# Altium project PnP.PrjPcb (part 2 of 2)

## Sheet ENET.SchDoc: ENET PHY
size 431 x 279 mm; Author: Shivam Sharma; SheetNumber: 4; SheetTotal: 14; SheetRevision: 1.0
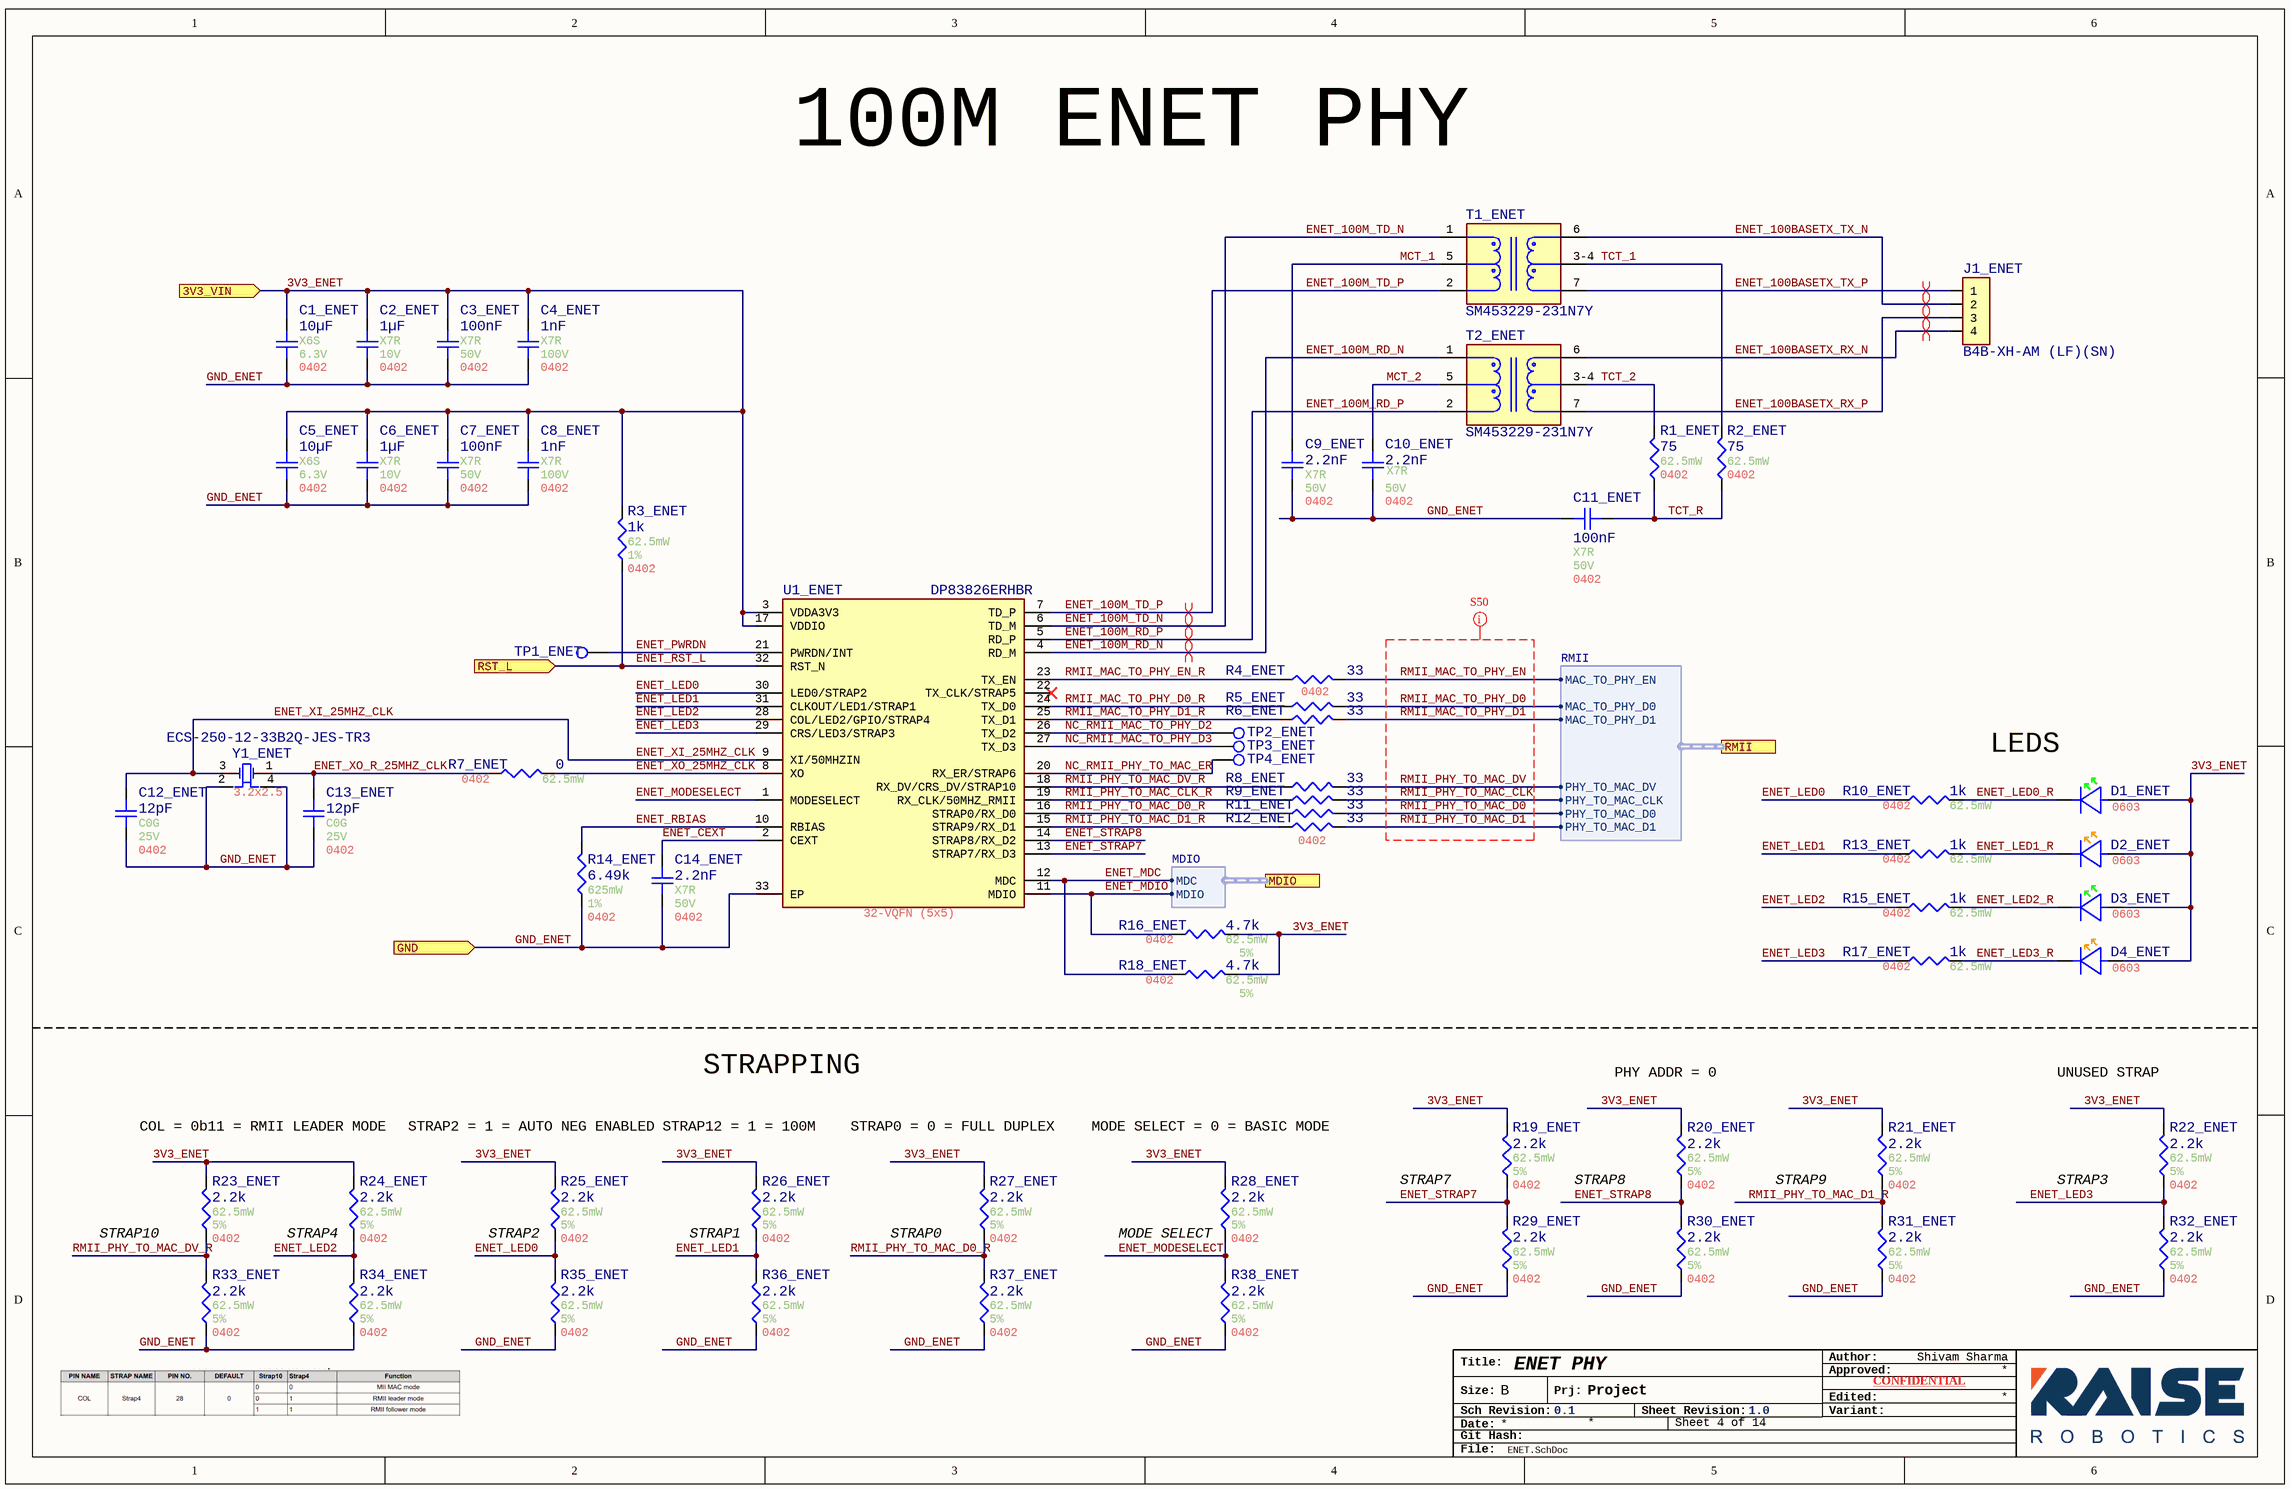
[diagram p6: ENET.SchDoc]

### Parts
C1_ENET  value 10µF  Temperature Coefficient: X6S  Voltage Rating: 6.3V  Case/Package: 0402  [Generic 0402 capacitor]  (hidden comment: GRT155C80J106ME13J)
C2_ENET  value 1µF  Temperature Coefficient: X7R  Voltage Rating: 10V  Case/Package: 0402  [Generic 0402 capacitor]  (hidden comment: MAASL105CD7105MFCA01)
C3_ENET  value 100nF  Temperature Coefficient: X7R  Voltage Rating: 50V  Case/Package: 0402  [Generic 0402 capacitor]  (hidden comment: GRT155R71H104KE01D)
C4_ENET  value 1nF  Temperature Coefficient: X7R  Voltage Rating: 100V  Case/Package: 0402  [Generic 0402 capacitor]  (hidden comment: GCM155R72A102KA37J)
C5_ENET  value 10µF  Temperature Coefficient: X6S  Voltage Rating: 6.3V  Case/Package: 0402  [Generic 0402 capacitor]  (hidden comment: GRT155C80J106ME13J)
C6_ENET  value 1µF  Temperature Coefficient: X7R  Voltage Rating: 10V  Case/Package: 0402  [Generic 0402 capacitor]  (hidden comment: MAASL105CD7105MFCA01)
C7_ENET  value 100nF  Temperature Coefficient: X7R  Voltage Rating: 50V  Case/Package: 0402  [Generic 0402 capacitor]  (hidden comment: GRT155R71H104KE01D)
C8_ENET  value 1nF  Temperature Coefficient: X7R  Voltage Rating: 100V  Case/Package: 0402  [Generic 0402 capacitor]  (hidden comment: GCM155R72A102KA37J)
C9_ENET  value 2.2nF  Temperature Coefficient: X7R  Voltage Rating: 50V  Case/Package: 0402  [Generic 0402 capacitor]  (hidden comment: CGA2B2X7R1H222K050BA)
C10_ENET  value 2.2nF  Temperature Coefficient: X7R  Voltage Rating: 50V  Case/Package: 0402  [Generic 0402 capacitor]  (hidden comment: CGA2B2X7R1H222K050BA)
C11_ENET  value 100nF  Temperature Coefficient: X7R  Voltage Rating: 50V  Case/Package: 0402  [Generic 0402 capacitor]  (hidden comment: GRT155R71H104KE01D)
C12_ENET  value 12pF  Temperature Coefficient: C0G  Voltage Rating: 25V  Case/Package: 0402  [Generic 0402 capacitor]  (hidden comment: GRT1555C1E120JA02J)
C13_ENET  value 12pF  Temperature Coefficient: C0G  Voltage Rating: 25V  Case/Package: 0402  [Generic 0402 capacitor]  (hidden comment: GRT1555C1E120JA02J)
C14_ENET  value 2.2nF  Temperature Coefficient: X7R  Voltage Rating: 50V  Case/Package: 0402  [Generic 0402 capacitor]  (hidden comment: CGA2B2X7R1H222K050BA)
D1_ENET  Case/Package: 0603  [SML-D12P8WT86C]  (hidden comment: SML-D12P8WT86C)
D2_ENET  Case/Package: 0603  [FP-SML-D12-MFG]  (hidden comment: SML-D12D8WT86C)
D3_ENET  Case/Package: 0603  [SML-D12P8WT86C]  (hidden comment: SML-D12P8WT86C)
D4_ENET  Case/Package: 0603  [FP-SML-D12-MFG]  (hidden comment: SML-D12D8WT86C)
J1_ENET  B4B-XH-AM (LF)(SN)  [FP-B4B-XH-AM_LF_SN-MFG]
R1_ENET  value 75  Power: 62.5mW  Case/Package: 0402  [Generic 0402 Resistor]  (hidden comment: WR04X75R0FTL)
R2_ENET  value 75  Power: 62.5mW  Case/Package: 0402  [Generic 0402 Resistor]  (hidden comment: WR04X75R0FTL)
R3_ENET  value 1k  Power: 62.5mW  Tolerance: 1%  Case/Package: 0402  [Generic 0402 Resistor]  (hidden comment: WR04X1001FTL)
R4_ENET  value 33  [Generic 0402 Resistor]  (hidden comment: RMCA0402FT33R0-HP)
R5_ENET  value 33  [Generic 0402 Resistor]  (hidden comment: RMCA0402FT33R0-HP)
R6_ENET  value 33  Case/Package: 0402  [Generic 0402 Resistor]  (hidden comment: RMCA0402FT33R0-HP)
R7_ENET  value 0  Power: 62.5mW  Case/Package: 0402  [Generic 0402 Resistor]  (hidden comment: WR04X000PTL)
R8_ENET  value 33  [Generic 0402 Resistor]  (hidden comment: RMCA0402FT33R0-HP)
R9_ENET  value 33  [Generic 0402 Resistor]  (hidden comment: RMCA0402FT33R0-HP)
R10_ENET  value 1k  Power: 62.5mW  Case/Package: 0402  [Generic 0402 Resistor]  (hidden comment: WR04X1001FTL)
R11_ENET  value 33  [Generic 0402 Resistor]  (hidden comment: RMCA0402FT33R0-HP)
R12_ENET  value 33  Case/Package: 0402  [Generic 0402 Resistor]  (hidden comment: RMCA0402FT33R0-HP)
R13_ENET  value 1k  Power: 62.5mW  Case/Package: 0402  [Generic 0402 Resistor]  (hidden comment: WR04X1001FTL)
R14_ENET  value 6.49k  Power: 625mW  Tolerance: 1%  Case/Package: 0402  [Generic 0402 Resistor]  (hidden comment: AC0402FR-076K49L)
R15_ENET  value 1k  Power: 62.5mW  Case/Package: 0402  [Generic 0402 Resistor]  (hidden comment: WR04X1001FTL)
R16_ENET  value 4.7k  Power: 62.5mW  Tolerance: 5%  Case/Package: 0402  [Generic 0402 Resistor]  (hidden comment: WR04X472JTL)
R17_ENET  value 1k  Power: 62.5mW  Case/Package: 0402  [Generic 0402 Resistor]  (hidden comment: WR04X1001FTL)
R18_ENET  value 4.7k  Power: 62.5mW  Tolerance: 5%  Case/Package: 0402  [Generic 0402 Resistor]  (hidden comment: WR04X472JTL)
R19_ENET  value 2.2k  Power: 62.5mW  Tolerance: 5%  Case/Package: 0402  [Generic 0402 Resistor]  (hidden comment: CR0402-JW-222GLF)
R20_ENET  value 2.2k  Power: 62.5mW  Tolerance: 5%  Case/Package: 0402  [Generic 0402 Resistor]  (hidden comment: CR0402-JW-222GLF)
R21_ENET  value 2.2k  Power: 62.5mW  Tolerance: 5%  Case/Package: 0402  [Generic 0402 Resistor]  (hidden comment: CR0402-JW-222GLF)
R22_ENET  value 2.2k  Power: 62.5mW  Tolerance: 5%  Case/Package: 0402  [Generic 0402 Resistor]  (hidden comment: CR0402-JW-222GLF)
R23_ENET  value 2.2k  Power: 62.5mW  Tolerance: 5%  Case/Package: 0402  [Generic 0402 Resistor]  (hidden comment: CR0402-JW-222GLF)
R24_ENET  value 2.2k  Power: 62.5mW  Tolerance: 5%  Case/Package: 0402  [Generic 0402 Resistor]  (hidden comment: CR0402-JW-222GLF)
R25_ENET  value 2.2k  Power: 62.5mW  Tolerance: 5%  Case/Package: 0402  [Generic 0402 Resistor]  (hidden comment: CR0402-JW-222GLF)
R26_ENET  value 2.2k  Power: 62.5mW  Tolerance: 5%  Case/Package: 0402  [Generic 0402 Resistor]  (hidden comment: CR0402-JW-222GLF)
R27_ENET  value 2.2k  Power: 62.5mW  Tolerance: 5%  Case/Package: 0402  [Generic 0402 Resistor]  (hidden comment: CR0402-JW-222GLF)
R28_ENET  value 2.2k  Power: 62.5mW  Tolerance: 5%  Case/Package: 0402  [Generic 0402 Resistor]  (hidden comment: CR0402-JW-222GLF)
R29_ENET  value 2.2k  Power: 62.5mW  Tolerance: 5%  Case/Package: 0402  [Generic 0402 Resistor]  (hidden comment: CR0402-JW-222GLF)
R30_ENET  value 2.2k  Power: 62.5mW  Tolerance: 5%  Case/Package: 0402  [Generic 0402 Resistor]  (hidden comment: CR0402-JW-222GLF)
R31_ENET  value 2.2k  Power: 62.5mW  Tolerance: 5%  Case/Package: 0402  [Generic 0402 Resistor]  (hidden comment: CR0402-JW-222GLF)
R32_ENET  value 2.2k  Power: 62.5mW  Tolerance: 5%  Case/Package: 0402  [Generic 0402 Resistor]  (hidden comment: CR0402-JW-222GLF)
R33_ENET  value 2.2k  Power: 62.5mW  Tolerance: 5%  Case/Package: 0402  [Generic 0402 Resistor]  (hidden comment: CR0402-JW-222GLF)
R34_ENET  value 2.2k  Power: 62.5mW  Tolerance: 5%  Case/Package: 0402  [Generic 0402 Resistor]  (hidden comment: CR0402-JW-222GLF)
R35_ENET  value 2.2k  Power: 62.5mW  Tolerance: 5%  Case/Package: 0402  [Generic 0402 Resistor]  (hidden comment: CR0402-JW-222GLF)
R36_ENET  value 2.2k  Power: 62.5mW  Tolerance: 5%  Case/Package: 0402  [Generic 0402 Resistor]  (hidden comment: CR0402-JW-222GLF)
R37_ENET  value 2.2k  Power: 62.5mW  Tolerance: 5%  Case/Package: 0402  [Generic 0402 Resistor]  (hidden comment: CR0402-JW-222GLF)
R38_ENET  value 2.2k  Power: 62.5mW  Tolerance: 5%  Case/Package: 0402  [Generic 0402 Resistor]  (hidden comment: CR0402-JW-222GLF)
T1_ENET  SM453229-231N7Y  [SM453229-231N7Y]
T2_ENET  SM453229-231N7Y  [SM453229-231N7Y]
TP1_ENET  TP 0.75mm  [TP 0.75mm]  (value not drawn)  (no BOM)
TP2_ENET  TP 0.75mm  [TP 0.75mm]  (value not drawn)  (no BOM)
TP3_ENET  TP 0.75mm  [TP 0.75mm]  (value not drawn)  (no BOM)
TP4_ENET  TP 0.75mm  [TP 0.75mm]  (value not drawn)  (no BOM)
U1_ENET  DP83826ERHBR  Case/Package: 32-VQFN (5x5)  [DP83826ERHBR]
Y1_ENET  ECS-250-12-33B2Q-JES-TR3  Case/Package: 3.2x2.5  [ECS-250-12-33B2Q-JES-TR3]

### Ports
3V3_VIN (in), GND (in), MDIO (harness MDIO), RMII (harness RMII), RST_L (in)

### Harnesses
MDIO: MDIO, MDC
RMII: MAC_TO_PHY_D0, MAC_TO_PHY_D1, PHY_TO_MAC_D0, PHY_TO_MAC_CLK, PHY_TO_MAC_D1, MAC_TO_PHY_EN, PHY_TO_MAC_DV

### Nets
3V3_ENET: C1_ENET.2 C2_ENET.2 C3_ENET.2 C4_ENET.2 C5_ENET.2 C6_ENET.2 C7_ENET.2 C8_ENET.2 D1_ENET.2(A) D2_ENET.2(A) D3_ENET.2(A) D4_ENET.2(A) R3_ENET.2 R16_ENET.2 R18_ENET.2 R19_ENET.2 R20_ENET.2 R21_ENET.2 R22_ENET.2 R23_ENET.2 R24_ENET.2 R25_ENET.2 R26_ENET.2 R27_ENET.2 R28_ENET.2 U1_ENET.3(VDDA3V3) U1_ENET.17(VDDIO) ; port 3V3_VIN  [project net 3V3_LOGIC]
GND_ENET: C1_ENET.1 C2_ENET.1 C3_ENET.1 C4_ENET.1 C5_ENET.1 C6_ENET.1 C7_ENET.1 C8_ENET.1 C9_ENET.1 C10_ENET.1 C11_ENET.2 C12_ENET.1 C13_ENET.1 C14_ENET.1 R14_ENET.1 R29_ENET.1 R30_ENET.1 R31_ENET.1 R32_ENET.1 R33_ENET.1 R34_ENET.1 R35_ENET.1 R36_ENET.1 R37_ENET.1 R38_ENET.1 U1_ENET.33(EP) Y1_ENET.2 Y1_ENET.4 ; port GND  [project net GND]
ENET_100BASETX_RX_N: J1_ENET.4 T2_ENET.6
ENET_100BASETX_RX_P: J1_ENET.3 T2_ENET.7
ENET_100BASETX_TX_N: J1_ENET.2 T1_ENET.6
ENET_100BASETX_TX_P: J1_ENET.1 T1_ENET.7
ENET_100M_RD_N: T2_ENET.1 U1_ENET.4(RD_M)
ENET_100M_RD_P: T2_ENET.2 U1_ENET.5(RD_P)
ENET_100M_TD_N: T1_ENET.1 U1_ENET.6(TD_M)
ENET_100M_TD_P: T1_ENET.2 U1_ENET.7(TD_P)
ENET_CEXT: C14_ENET.2 U1_ENET.2(CEXT)
ENET_LED0: R10_ENET.1 R25_ENET.1 R35_ENET.2 U1_ENET.30(LED0/STRAP2)
ENET_LED0_R: D1_ENET.1(C) R10_ENET.2
ENET_LED1: R13_ENET.1 R26_ENET.1 R36_ENET.2 U1_ENET.31(CLKOUT/LED1/STRAP1)
ENET_LED1_R: D2_ENET.1(C) R13_ENET.2
ENET_LED2: R15_ENET.1 R24_ENET.1 R34_ENET.2 U1_ENET.28(COL/LED2/GPIO/STRAP4)
ENET_LED2_R: D3_ENET.1(C) R15_ENET.2
ENET_LED3: R17_ENET.1 R22_ENET.1 R32_ENET.2 U1_ENET.29(CRS/LED3/STRAP3)
ENET_LED3_R: D4_ENET.1(C) R17_ENET.2
ENET_MDC: R18_ENET.1 U1_ENET.12(MDC) ; port MDIO.MDC
ENET_MDIO: R16_ENET.1 U1_ENET.11(MDIO) ; port MDIO.MDIO
ENET_MODESELECT: R28_ENET.1 R38_ENET.2 U1_ENET.1(MODESELECT)
ENET_PWRDN: TP1_ENET.1 U1_ENET.21(PWRDN/INT)
ENET_RBIAS: R14_ENET.2 U1_ENET.10(RBIAS)
ENET_RST_L: R3_ENET.1 U1_ENET.32(RST_N) ; port RST_L
ENET_STRAP7: R19_ENET.1 R29_ENET.2 U1_ENET.13(STRAP7/RX_D3)
ENET_STRAP8: R20_ENET.1 R30_ENET.2 U1_ENET.14(STRAP8/RX_D2)
ENET_XI_25MHZ_CLK: C12_ENET.2 U1_ENET.9(XI/50MHZIN) Y1_ENET.3
ENET_XO_25MHZ_CLK: R7_ENET.2 U1_ENET.8(XO)
ENET_XO_R_25MHZ_CLK: C13_ENET.2 R7_ENET.1 Y1_ENET.1
MCT_1: C9_ENET.2 T1_ENET.5
MCT_2: C10_ENET.2 T2_ENET.5
NC_RMII_MAC_TO_PHY_D2: TP2_ENET.1 U1_ENET.26(TX_D2)
NC_RMII_MAC_TO_PHY_D3: TP3_ENET.1 U1_ENET.27(TX_D3)
NC_RMII_PHY_TO_MAC_ER: TP4_ENET.1 U1_ENET.20(RX_ER/STRAP6)
RMII_MAC_TO_PHY_D0: R5_ENET.2 ; port RMII.MAC_TO_PHY_D0
RMII_MAC_TO_PHY_D0_R: R5_ENET.1 U1_ENET.24(TX_D0)
RMII_MAC_TO_PHY_D1: R6_ENET.2 ; port RMII.MAC_TO_PHY_D1
RMII_MAC_TO_PHY_D1_R: R6_ENET.1 U1_ENET.25(TX_D1)
RMII_MAC_TO_PHY_EN: R4_ENET.2 ; port RMII.MAC_TO_PHY_EN
RMII_MAC_TO_PHY_EN_R: R4_ENET.1 U1_ENET.23(TX_EN)
RMII_PHY_TO_MAC_CLK: R9_ENET.2 ; port RMII.PHY_TO_MAC_CLK
RMII_PHY_TO_MAC_CLK_R: R9_ENET.1 U1_ENET.19(RX_CLK/50MHZ_RMII)
RMII_PHY_TO_MAC_D0: R11_ENET.2 ; port RMII.PHY_TO_MAC_D0
RMII_PHY_TO_MAC_D0_R: R11_ENET.1 R27_ENET.1 R37_ENET.2 U1_ENET.16(STRAP0/RX_D0)
RMII_PHY_TO_MAC_D1: R12_ENET.2 ; port RMII.PHY_TO_MAC_D1
RMII_PHY_TO_MAC_D1_R: R12_ENET.1 R21_ENET.1 R31_ENET.2 U1_ENET.15(STRAP9/RX_D1)
RMII_PHY_TO_MAC_DV: R8_ENET.2 ; port RMII.PHY_TO_MAC_DV
RMII_PHY_TO_MAC_DV_R: R8_ENET.1 R23_ENET.1 R33_ENET.2 U1_ENET.18(RX_DV/CRS_DV/STRAP10)
TCT_1: R2_ENET.2 T1_ENET.3-4
TCT_2: R1_ENET.2 T2_ENET.3-4
TCT_R: C11_ENET.1 R1_ENET.1 R2_ENET.1

Not connected (* = marked no-connect by the designer): U1_ENET 22(TX_CLK/STRAP5)*

### Layout directives
differential pair: ENET_100BASETX_RX_N, ENET_100BASETX_RX_P, ENET_100BASETX_TX_N, ENET_100BASETX_TX_P, ENET_100M_RD_N, ENET_100M_RD_P, ENET_100M_TD_N, ENET_100M_TD_P
net class S50: RMII_MAC_TO_PHY_D0, RMII_MAC_TO_PHY_D1, RMII_MAC_TO_PHY_EN, RMII_PHY_TO_MAC_CLK, RMII_PHY_TO_MAC_D0, RMII_PHY_TO_MAC_D1, RMII_PHY_TO_MAC_DV

### Notes on the sheet
- 100M ENET PHY
- LEDS
- STRAPPING
- PHY ADDR = 0
- UNUSED STRAP
- COL = 0b11 = RMII LEADER MODE
- STRAP2 = 1 = AUTO NEG ENABLED
- STRAP12 = 1 = 100M
- STRAP0 = 0 = FULL DUPLEX
- MODE SELECT = 0 = BASIC MODE
- STRAP10
- (near R24_ENET) STRAP4
- (near R25_ENET) STRAP2
- (near R26_ENET) STRAP1
- STRAP0
- (near R28_ENET) MODE SELECT
- STRAP7
- STRAP8
- STRAP9
- STRAP3
- Title:
- Author:
- Approved:
- Size:
- Date:
- Git Hash:
- Sch Revision:
- B
- Prj:
- Sheet Revision:
- Variant:
- Edited:
- CONFIDENTIAL
- File:

### Library data of the parts
C1_ENET C5_ENET = CMP-001-00108-2: Multilayer Ceramic Capacitors MLCC - SMD/SMT 0402 10uF 6.3VDC 20% X6S AEC-Q200; AECQ: Yes; Mounting Technology: Surface Mount; Max Operating Temperature: 105°C; Min Operating Temperature: -55°C; Tolerance: 20%; Pins: 2; RoHS Compliant: Yes; Capacitor Type: Ceramic
C2_ENET C6_ENET = CMP-001-00104-2: Cap Cer 1UF 20V X7T 0402; Capacitor Type: Ceramic; AECQ: Yes; Tolerance: 20%; Max Operating Temperature: 125°C; Min Operating Temperature: -55°C; Mounting Technology: Surface Mount; RoHS Compliant: Yes; Pins: 2
C3_ENET C7_ENET C11_ENET = CMP-001-00084-12: Ceramic Capacitor, Multilayer, Ceramic, 50V, 10% +Tol, 10% -Tol, X7R, 15% TC, 0.1uF, Surface Mount, 0402; AECQ: Yes; Reach SVHC Compliant: Yes; Mounting Technology: Surface Mount; Termination: Wraparound; Pins: 2; Packaging: Tape and Reel; Package Shape: Rectangular; Multilayer: Yes; Tolerance: 10%; Max Operating Temperature: 125°C; Terminal Finish: Nickel; Capacitor Type: Ceramic; Dielectric Material: Ceramic; Min Operating Temperature: -55°C; RoHS Compliant: Yes
C4_ENET C8_ENET = CMP-001-00101-2: Ceramic Capacitor, Multilayer, Ceramic, 100V, 10% +Tol, 10% -Tol, X7R, 15% TC, 0.001uF, Surface Mount, 0402; AECQ: Yes; Pins: 2; Tolerance: 10%; Max Operating Temperature: 125°C; Capacitor Type: Ceramic; Mounting Technology: SMD; Min Operating Temperature: -55°C
C9_ENET C10_ENET C14_ENET = CMP-001-00093-4: 50V 2.2nF X7R 卤10% 0402 Multilayer Ceramic Capacitors MLCC - SMD/SMT ROHS; Multilayer: Yes; Tolerance: 10%; Max Operating Temperature: 150°C; AECQ: Yes; Reach SVHC Compliant: Yes; Package Shape: Rectangular; Dielectric Material: Ceramic; Min Operating Temperature: -55°C; Packaging: Tape and Reel; RoHS Compliant: Yes; Capacitor Type: Ceramic; Mounting Technology: Surface Mount; Pins: 2
C12_ENET C13_ENET = CMP-001-00109-2: Ceramic Capacitor, Multilayer, Ceramic, 25V, 5% +Tol, 5% -Tol, C0G, 30ppm/Cel TC, 0.000012uF, Surface Mount, 0402; AECQ: Yes; Pins: 2; Mounting Technology: Surface Mount; Min Operating Temperature: -55°C; RoHS Compliant: Yes; Max Operating Temperature: 125°C; Tolerance: 5%; Capacitor Type: Ceramic
D1_ENET D3_ENET = CMP-007-00039-1: Green 560nm LED Indication - Discrete 2.2V 0603 (1608 Metric); Forward Voltage: 2.2V; Pins: 2; Colour: Green
D2_ENET D4_ENET = CMP-007-00038-1: Orange 605nm LED Indication - Discrete 2.2V 0603 (1608 Metric); Colour: Orange; Forward Voltage: 2.2V; Pins: 2
J1_ENET = CMP-002-00133-1: Header, Xh, Top, 4Way, 2.5Mm, Boss;; Manufacturer: JST; Max Current Rating: 3A; Gender: Male; Pitch: 2.4892mm; Voltage Rating: 250V; Length: 12.4mm; Min Operating Temperature: -25°C; Max Operating Temperature: 85°C; Pins: 4; Manufacturer Series: XH; Case/Package: THT; Height: 7mm; Connector Type: Header
R1_ENET R2_ENET = CMP-009-00181-8: Fixed Resistor, Metal Glaze/thick Film, 0.0625W, 75ohm, 50V, 1% +/-Tol, 100ppm/Cel, Surface Mount, 0402; Manufacturer Part Number: Blank; Package Height: 0.35mm; AECQ: No; Package Length: 1mm; Rated Temperature: 70°C; Package Width: 0.5mm; Temperature Coefficient (ppm/Cel): 100; Additional Feature: LASER TRIMMABLE; Tolerance: 1%; Terminal Finish: Nickel; Construction: Chip; Resistor Type: FIXED RESISTOR; Max Operating Temperature: 155°C; Technology: METAL GLAZE/THICK FILM; Min Operating Temperature: -55°C; Package Shape: Rectangular; JESD-609 Code: e3; Working Voltage: 50V; RoHS Compliant: Yes; Packaging: Tape and Reel; Reach SVHC Compliant: Yes; Termination: Wraparound; Mounting Technology: Surface Mount; Pins: 2
R3_ENET R10_ENET R13_ENET R15_ENET R17_ENET = CMP-009-00182-8: Fixed Resistor, Metal Glaze/thick Film, 0.0625W, 1000ohm, 50V, 1% +/-Tol, 100ppm/Cel, Surface Mount, 0402; Manufacturer Part Number: Blank; Package Width: 0.5mm; Rated Temperature: 70°C; AECQ: No; Package Length: 1mm; Additional Feature: LASER TRIMMABLE; Package Height: 0.35mm; Temperature Coefficient (ppm/Cel): 100; RoHS Compliant: Yes; Working Voltage: 50V; Min Operating Temperature: -55°C; Pins: 2; Reach SVHC Compliant: Yes; Technology: METAL GLAZE/THICK FILM; Terminal Finish: Nickel; Max Operating Temperature: 155°C; Resistor Type: FIXED RESISTOR; Package Shape: Rectangular; Mounting Technology: Surface Mount; Termination: Wraparound; JESD-609 Code: e3; Packaging: Tape and Reel; Construction: Chip
  R10_ENET R13_ENET R15_ENET R17_ENET: Tolerance: 1%
R4_ENET R5_ENET R6_ENET R8_ENET R9_ENET R11_ENET R12_ENET = CMP-009-00205-4: Fixed Resistor, Metal Glaze/thick Film, 0.1W, 33ohm, 50V, 1% +/-Tol, 100ppm/Cel, Surface Mount, 0402; Power: 625mW; AECQ: Yes; Tolerance: 1%; Max Operating Temperature: 155°C; Pins: 2; Min Operating Temperature: -55°C; Voltage Rating: 50V; Mounting Technology: SMD
  R4_ENET R5_ENET R8_ENET R9_ENET R11_ENET: Case/Package: 0402
R7_ENET = CMP-009-00186-8: Fixed Resistor, Metal Glaze/thick Film, 0.0625W, 0ohm, Surface Mount, 0402; Manufacturer Part Number: Blank; Tolerance: 0%; AECQ: No; Package Width: 0.5mm; Rated Temperature: 70°C; Package Height: 0.35mm; Package Length: 1mm; Mounting Technology: Surface Mount; Resistor Type: FIXED RESISTOR; Packaging: Tape and Reel; Pins: 2; JESD-609 Code: e3; RoHS Compliant: Yes; Termination: Wraparound; Construction: Chip; Technology: METAL GLAZE/THICK FILM; Package Shape: Rectangular; Max Operating Temperature: 155°C; Terminal Finish: Nickel; Min Operating Temperature: -55°C; Reach SVHC Compliant: Yes
R14_ENET = CMP-009-00204-3: Fixed Resistor, Metal Glaze/thick Film, 0.0625W, 6490ohm, 50V, 1% +/-Tol, 100ppm/Cel, Surface Mount, 0402; AECQ: Yes; Min Operating Temperature: -55°C; Max Operating Temperature: 155°C; Pins: 2; Mounting Technology: SMD
R16_ENET R18_ENET = CMP-009-00184-8: Fixed Resistor, Metal Glaze/thick Film, 0.0625W, 4700ohm, 50V, 5% +/-Tol, 100ppm/Cel, Surface Mount, 0402; Manufacturer Part Number: Blank; Package Height: 0.35mm; Package Length: 1mm; Rated Temperature: 70°C; Package Width: 0.5mm; AECQ: No; Temperature Coefficient (ppm/Cel): 200; Additional Feature: LASER TRIMMABLE; Mounting Technology: Surface Mount; Technology: METAL GLAZE/THICK FILM; RoHS Compliant: Yes; Resistor Type: FIXED RESISTOR; Package Shape: Rectangular; Pins: 2; Construction: Chip; Terminal Finish: Nickel; Max Operating Temperature: 155°C; Working Voltage: 50V; Packaging: Tape and Reel; Termination: Wraparound; JESD-609 Code: e3; Reach SVHC Compliant: Yes; Min Operating Temperature: -55°C
R19_ENET R20_ENET R21_ENET R22_ENET R23_ENET R24_ENET R25_ENET R26_ENET R27_ENET R28_ENET R29_ENET R30_ENET R31_ENET R32_ENET R33_ENET R34_ENET R35_ENET R36_ENET R37_ENET R38_ENET = CMP-009-00183-8: Fixed Resistor, Metal Glaze/thick Film, 0.0625W, 2200ohm, 50V, 5% +/-Tol, 200ppm/Cel, Surface Mount, 0402; Manufacturer Part Number: Blank; Package Width: 0.5mm; Rated Temperature: 70°C; AECQ: No; Package Length: 1mm; Package Height: 0.35mm; Temperature Coefficient (ppm/Cel): 200; RoHS Compliant: Yes; Working Voltage: 50V; Min Operating Temperature: -55°C; Pins: 2; Reach SVHC Compliant: No; Technology: RUTHENIUM OXIDE; Terminal Finish: Nickel; Max Operating Temperature: 125°C; Resistor Type: FIXED RESISTOR; Package Shape: Rectangular; Mounting Technology: Surface Mount; Termination: Wraparound; JESD-609 Code: e3; Packaging: Tape and Reel; Construction: Chip
T1_ENET T2_ENET = CMP-00000-3: CHIP LAN,10/100/1G XFORMER,POE,4; RoHS Compliant: Yes
TP1_ENET TP2_ENET TP3_ENET TP4_ENET = CMP-00009-1: 0.75mm circular test point; Size: 0.75mm
U1_ENET = CMP-031-00009-2: Ethernet Transceiver, 1-Trnsvr, PQCC32; AECQ: No; Max Operating Temperature: 105°C; Min Operating Temperature: -40°C; Pins: 32; MPN: DP83826ERHBR
Y1_ENET = CMP-003-00030-1: Crystal 25.000 Mhz 12PF SMD; AECQ: Yes; ESR: 50; Frequency: 25MHz; Mounting Technology: SMD; Min Operating Temperature: -40°C; Load Capacitance: 12pF; Pins: 4; Max Operating Temperature: 125°C

## Sheet SD_Card.SchDoc: SD Card
size 431 x 279 mm; SheetNumber: 11; SheetTotal: 14; SheetRevision: 1.0
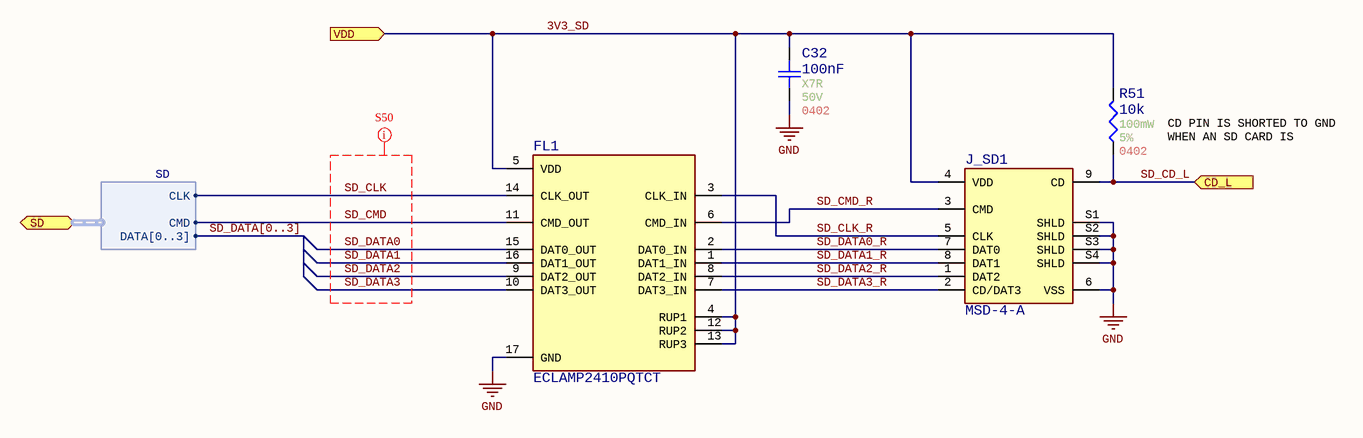
[diagram p7: SD_Card.SchDoc]

### Parts
C32  value 100nF  Temperature Coefficient: X7R  Voltage Rating: 50V  Case/Package: 0402  [Generic 0402 capacitor]  (hidden comment: GRT155R71H104KE01D)
FL1  ECLAMP2410PQTCT  [ECLAMP2410PQTCT]
J_SD1  MSD-4-A  [MSD-4-A]
R51  value 10k  Power: 100mW  Tolerance: 5%  Case/Package: 0402  [Generic 0402 Resistor]  (hidden comment: ERJ-2GEJ103X)

### Ports
CD_L (in), SD (bidir, harness SD), VDD (in)

### Harnesses
SD: DATA[0..3], CLK, CMD

### Nets
3V3_SD: C32.2 FL1.4(RUP1) FL1.5(VDD) FL1.12(RUP2) FL1.13(RUP3) J_SD1.4(VDD) R51.2 ; port VDD  [project net 3V3_LOGIC]
GND: C32.1 FL1.17(GND) J_SD1.6(VSS) J_SD1.S1(SHLD) J_SD1.S2(SHLD) J_SD1.S3(SHLD) J_SD1.S4(SHLD)
SD_CD_L: J_SD1.9(CD) R51.1 ; port CD_L
SD_CLK: FL1.14(CLK_OUT) ; port SD.CLK
SD_CLK_R: FL1.3(CLK_IN) J_SD1.5(CLK)
SD_CMD: FL1.11(CMD_OUT) ; port SD.CMD
SD_CMD_R: FL1.6(CMD_IN) J_SD1.3(CMD)
SD_DATA0: FL1.15(DAT0_OUT)
SD_DATA0_R: FL1.2(DAT0_IN) J_SD1.7(DAT0)
SD_DATA1: FL1.16(DAT1_OUT)
SD_DATA1_R: FL1.1(DAT1_IN) J_SD1.8(DAT1)
SD_DATA2: FL1.9(DAT2_OUT)
SD_DATA2_R: FL1.8(DAT2_IN) J_SD1.1(DAT2)
SD_DATA3: FL1.10(DAT3_OUT)
SD_DATA3_R: FL1.7(DAT3_IN) J_SD1.2(CD/DAT3)

### Buses and harness runs
bus SD_DATA[0..3]

### Layout directives
net class S50: SD_CLK, SD_CMD, SD_DATA0, SD_DATA1, SD_DATA2, SD_DATA3

### Notes on the sheet
- CD PIN IS SHORTED TO GND WHEN AN SD CARD IS PRESENT
- Title:
- Author:
- Approved:
- Size:
- Date:
- Git Hash:
- Sch Revision:
- B
- Prj:
- Sheet Revision:
- Variant:
- Edited:
- CONFIDENTIAL
- File:

### Library data of the parts
C32 = CMP-001-00084-12: as C3_ENET on sheet ENET; Reach SVHC Compliant: Yes; Mounting Technology: Surface Mount; Termination: Wraparound; Pins: 2; Packaging: Tape and Reel; Package Shape: Rectangular; Multilayer: Yes; Tolerance: 10%; Max Operating Temperature: 125°C; Terminal Finish: Nickel; Capacitor Type: Ceramic; Dielectric Material: Ceramic; Min Operating Temperature: -55°C; RoHS Compliant: Yes
FL1 = CMP-004-00034-1: EMI Filter with Integrated ESD Protection 12pF 40dB 5V Flat Style SMD 16-Pin SLP4016P16 T/R; Polarity: Bidirectional; Min Breakdown Voltage: 6V; ESD Protection: Yes; Max Breakdown Voltage: 10V; Min Operating Temperature: -40°C; REACH SVHC: Yes; Lifecycle Status: Production; RoHS: Compliant; Packaging: Tape & Reel (TR); Reverse Standoff Voltage: 5V; Max Operating Temperature: 125°C; Width: 1.6002mm; China RoHS: Compliant; Height: 660.4µm; Schedule B: 8542390000; Length: 3.9878mm
J_SD1 = CMP-002-00094-1: Micro SD Card Connector, 9 Positions, Connector and Ejector, Push In, Auto Eject Out, Surface Mount, 1.8 mm Height...; Manufacturer: Same Sky; Gender: Female; Max Current Rating: 500mA; Connector Type: SD Card; Manufacturer Series: SD; Case/Package: SD (Micro); Pins: 9
R51 = CMP-009-00185-9: Res Thick Film 0402 10K Ohm 5% 1/10W ±200ppm/°C Molded SMD Punched Carrier T/R; AECQ: No; Pins: 2; Max Operating Temperature: 155°C; RoHS Compliant: Yes; Min Operating Temperature: -55°C; Mounting Technology: Surface Mount

## Sheet button_input.SchDoc
size 431 x 279 mm; Author: Shivam Sharma; SheetNumber: 10; SheetTotal: 14
Used 8 times, as channels BTN1, BTN2, BTN3, BTN4, BTN5, BTN6, BTN7, BTN8. Parts and nets are listed once, with the designators drawn on the sheet.
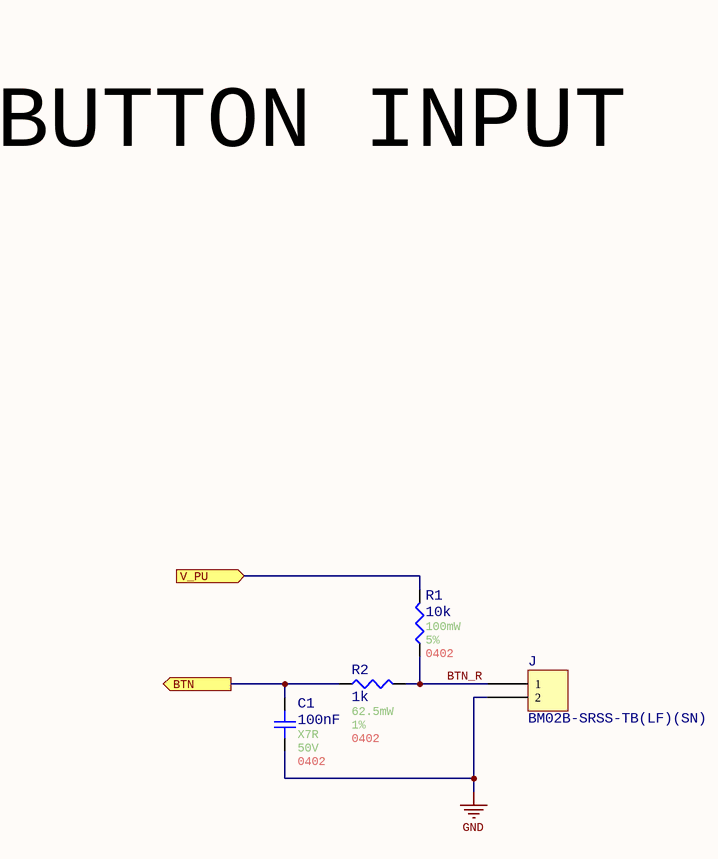
[diagram p8: button_input.SchDoc]

### Parts
C1  value 100nF  Temperature Coefficient: X7R  Voltage Rating: 50V  Case/Package: 0402  [Generic 0402 capacitor]  (hidden comment: GRT155R71H104KE01D)
J  BM02B-SRSS-TB(LF)(SN)  [JST BM02B-SRSS-TB]
R1  value 10k  Power: 100mW  Tolerance: 5%  Case/Package: 0402  [Generic 0402 Resistor]  (hidden comment: ERJ-2GEJ103X)
R2  value 1k  Power: 62.5mW  Tolerance: 1%  Case/Package: 0402  [Generic 0402 Resistor]  (hidden comment: WR04X1001FTL)

### Ports
BTN (out), V_PU (in)

### Nets
GND: C1.1 J.2
BTN: C1.2 R2.1 ; port BTN
BTN_R: J.1 R1.1 R2.2
V_PU: R1.2 ; port V_PU

### Channels
BTN1: designators end in _BTN1; ports BTN=BTN1 V_PU=3V3_MCU
BTN2: designators end in _BTN2; ports BTN=BTN2 V_PU=3V3_MCU
BTN3: designators end in _BTN3; ports BTN=BTN3 V_PU=3V3_MCU
BTN4: designators end in _BTN4; ports BTN=BTN4 V_PU=3V3_MCU
BTN5: designators end in _BTN5; ports BTN=BTN5 V_PU=3V3_MCU
BTN6: designators end in _BTN6; ports BTN=BTN6 V_PU=3V3_MCU
BTN7: designators end in _BTN7; ports BTN=BTN7 V_PU=3V3_MCU
BTN8: designators end in _BTN8; ports BTN=BTN8 V_PU=3V3_MCU

### Notes on the sheet
- BUTTON INPUT
- Title:
- Author:
- Approved:
- Size:
- Date:
- Git Hash:
- Sch Revision:
- B
- Prj:
- SCH PN:
- Variant:
- Edited:
- CONFIDENTIAL
- File:

### Library data of the parts
C1 = CMP-001-00084-12: Ceramic Capacitor, Multilayer, Ceramic, 50V, 10% +Tol, 10% -Tol, X7R, 15% TC, 0.1uF, Surface Mount, 0402; Multilayer: Yes; Terminal Finish: Nickel; Capacitor Type: Ceramic; Package Shape: Rectangular; Reach SVHC Compliant: Yes; Max Operating Temperature: 125°C; RoHS Compliant: Yes; Termination: Wraparound; Packaging: Tape and Reel; AECQ: Yes; Pins: 2; Dielectric Material: Ceramic; Min Operating Temperature: -55°C; Tolerance: 10%; Mounting Technology: Surface Mount
J = BM02B-SRSS-TB(LF)(SN): CONN HEADER SMD 2POS 1MM; Manufacturer: JST Sales America Inc.; Current Rating (Amps): 0.7A; Material Flammability Rating: UL94 V-0; Number of Positions: 2; Number of Positions Loaded: All; Pitch - Mating: 0.039" (1.00mm); Shrouding: Shrouded - 4 Wall; Style: Board to Cable/Wire; Voltage Rating: 50V; Part Number: BM02B-SRSS-TB(LF)(SN); ComponentLink1Description: Datasheet; ComponentLink1URL: http://www.jst-mfg.com/product/pdf/eng/eSR.pdf; ComponentLink2Description: DigiKey Link; ComponentLink2URL: http://digikey.com/product-detail/en/jst-sales-america-inc/BM02B-SRSS-TB-LF-SN/455-1788-1-ND/926859; Connector Type: Header; Contact Finish - Mating: Tin; Contact Finish - Post: Tin; Contact Material: Copper Alloy; Contact Shape: Square; Contact Type: Male Pin; Fastening Type: Push-Pull; Features: Solder Retention; Insulation Color: Natural; Insulation Height: 0.167" (4.25mm); Insulation Material: Polyamide (PA), Nylon; LastUpdated: 1/12/2020 10:11:04 PM; Lifecycle Status: Active; Minimum Order: 1; Mounting Type: Surface Mount; Number of Rows: 1; Operating Temperature: -25°C ~ 85°C; Packaging: TapeAndReel; PartId: 12; Part Status: Active; Price: 0.22; Series: SR; Supplier 1: DigiKey; Supplier Part Number 1: 455-1788-1-ND; Termination: Solder
R1 = CMP-009-00185-9: as R51 on sheet SD_Card; Mounting Technology: Surface Mount; Max Operating Temperature: 155°C; Min Operating Temperature: -55°C; RoHS Compliant: Yes; Pins: 2
R2 = CMP-009-00182-8: Fixed Resistor, Metal Glaze/thick Film, 0.0625W, 1000ohm, 50V, 1% +/-Tol, 100ppm/Cel, Surface Mount, 0402; Manufacturer Part Number: Blank; AECQ: No; Package Height: 0.35mm; Additional Feature: LASER TRIMMABLE; Rated Temperature: 70°C; Package Length: 1mm; Temperature Coefficient (ppm/Cel): 100; Package Width: 0.5mm; RoHS Compliant: Yes; Technology: METAL GLAZE/THICK FILM; Max Operating Temperature: 155°C; Mounting Technology: Surface Mount; JESD-609 Code: e3; Terminal Finish: Nickel; Working Voltage: 50V; Min Operating Temperature: -55°C; Pins: 2; Reach SVHC Compliant: Yes; Termination: Wraparound; Resistor Type: FIXED RESISTOR; Packaging: Tape and Reel; Package Shape: Rectangular; Construction: Chip

## Sheet steppers.SchDoc: Steppers
size 431 x 279 mm; Author: Shivam Sharma; SheetNumber: 12; SheetTotal: 14; SheetRevision: 1.0
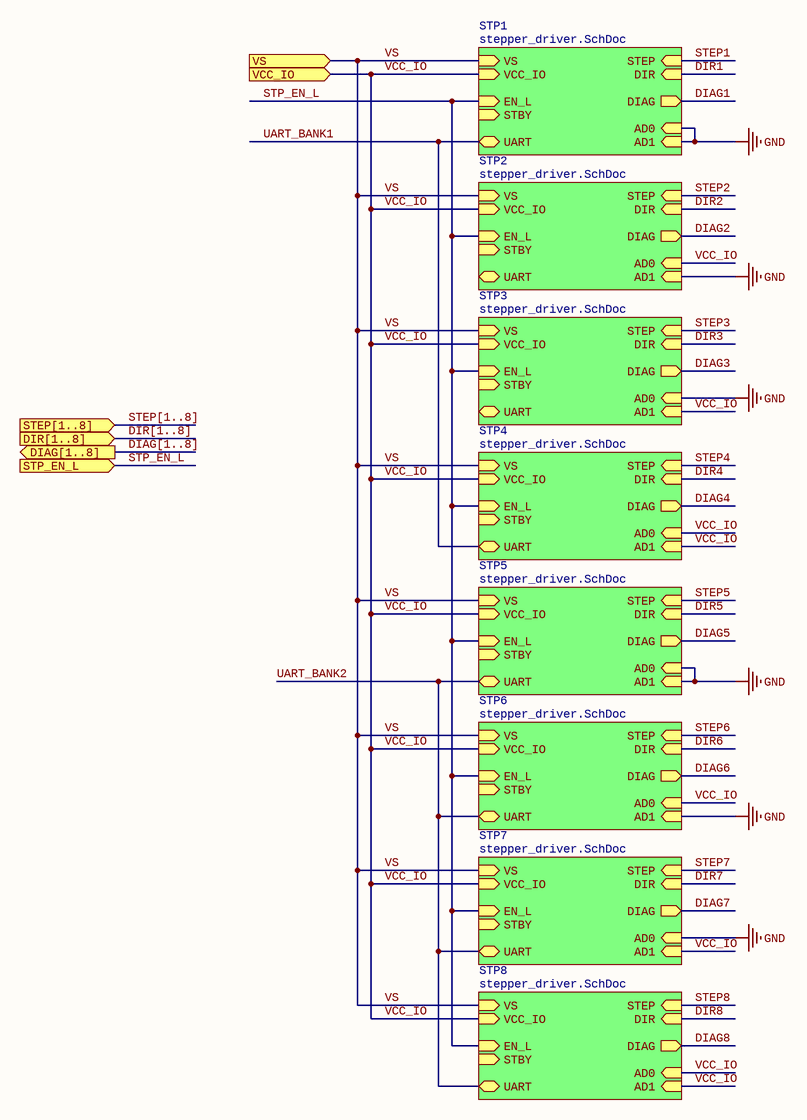
[diagram p9: steppers.SchDoc]

### Sub-sheets
STP1 = stepper_driver.SchDoc: VS (in), VCC_IO (in), STBY (in), EN_L (in), UART (bidir), DIR (in), STEP (in), AD0 (in), AD1 (in), DIAG (out)
STP2 = stepper_driver.SchDoc: VS (in), VCC_IO (in), STBY (in), EN_L (in), UART (bidir), DIR (in), STEP (in), AD0 (in), AD1 (in), DIAG (out)
STP3 = stepper_driver.SchDoc: VS (in), VCC_IO (in), STBY (in), EN_L (in), UART (bidir), DIR (in), STEP (in), AD0 (in), AD1 (in), DIAG (out)
STP4 = stepper_driver.SchDoc: VS (in), VCC_IO (in), STBY (in), EN_L (in), UART (bidir), DIR (in), STEP (in), AD0 (in), AD1 (in), DIAG (out)
STP5 = stepper_driver.SchDoc: VS (in), VCC_IO (in), STBY (in), EN_L (in), UART (bidir), DIR (in), STEP (in), AD0 (in), AD1 (in), DIAG (out)
STP6 = stepper_driver.SchDoc: VS (in), VCC_IO (in), STBY (in), EN_L (in), UART (bidir), DIR (in), STEP (in), AD0 (in), AD1 (in), DIAG (out)
STP7 = stepper_driver.SchDoc: VS (in), VCC_IO (in), STBY (in), EN_L (in), UART (bidir), DIR (in), STEP (in), AD0 (in), AD1 (in), DIAG (out)
STP8 = stepper_driver.SchDoc: VS (in), VCC_IO (in), STBY (in), EN_L (in), UART (bidir), DIR (in), STEP (in), AD0 (in), AD1 (in), DIAG (out)

### Ports
DIAG[1..8] (out), DIR[1..8] (in), STEP[1..8] (in), STP_EN_L (in), VCC_IO (in), VS (in)

### Nets
GND: sheet STP1/AD0, sheet STP1/AD1, sheet STP2/AD1, sheet STP3/AD0, sheet STP5/AD0, sheet STP5/AD1, sheet STP6/AD1, sheet STP7/AD0
VCC_IO: port VCC_IO, sheet STP1/VCC_IO, sheet STP2/VCC_IO, sheet STP2/AD0, sheet STP3/VCC_IO, sheet STP3/AD1, sheet STP4/VCC_IO, sheet STP4/AD0, sheet STP4/AD1, sheet STP5/VCC_IO, sheet STP6/VCC_IO, sheet STP6/AD0, sheet STP7/VCC_IO, sheet STP7/AD1, sheet STP8/VCC_IO, sheet STP8/AD0, sheet STP8/AD1  [project net 3V3_LOGIC]
VS: port VS, sheet STP1/VS, sheet STP2/VS, sheet STP3/VS, sheet STP4/VS, sheet STP5/VS, sheet STP6/VS, sheet STP7/VS, sheet STP8/VS  [project net 24V_MAIN]
STP_EN_L: port STP_EN_L, sheet STP1/EN_L, sheet STP2/EN_L, sheet STP3/EN_L, sheet STP4/EN_L, sheet STP5/EN_L, sheet STP6/EN_L, sheet STP7/EN_L, sheet STP8/EN_L
UART_BANK1: sheet STP1/UART, sheet STP4/UART
UART_BANK2: sheet STP5/UART, sheet STP6/UART, sheet STP7/UART, sheet STP8/UART

### Buses and harness runs
bus DIAG[1..8] = port DIAG[1..8]
bus DIR[1..8] = port DIR[1..8]
bus STEP[1..8] = port STEP[1..8]

### Notes on the sheet
- Title:
- Author:
- Approved:
- Size:
- Date:
- Git Hash:
- Sch Revision:
- B
- Prj:
- Sheet Revision:
- Variant:
- Edited:
- CONFIDENTIAL
- File:

## Sheet stepper_driver.SchDoc
size 431 x 279 mm; Author: Shivam Sharma; SheetNumber: 13; SheetTotal: 14
Used 8 times, as channels STP/STP1, STP/STP2, STP/STP3, STP/STP4, STP/STP5, STP/STP6, STP/STP7, STP/STP8. Parts and nets are listed once, with the designators drawn on the sheet.
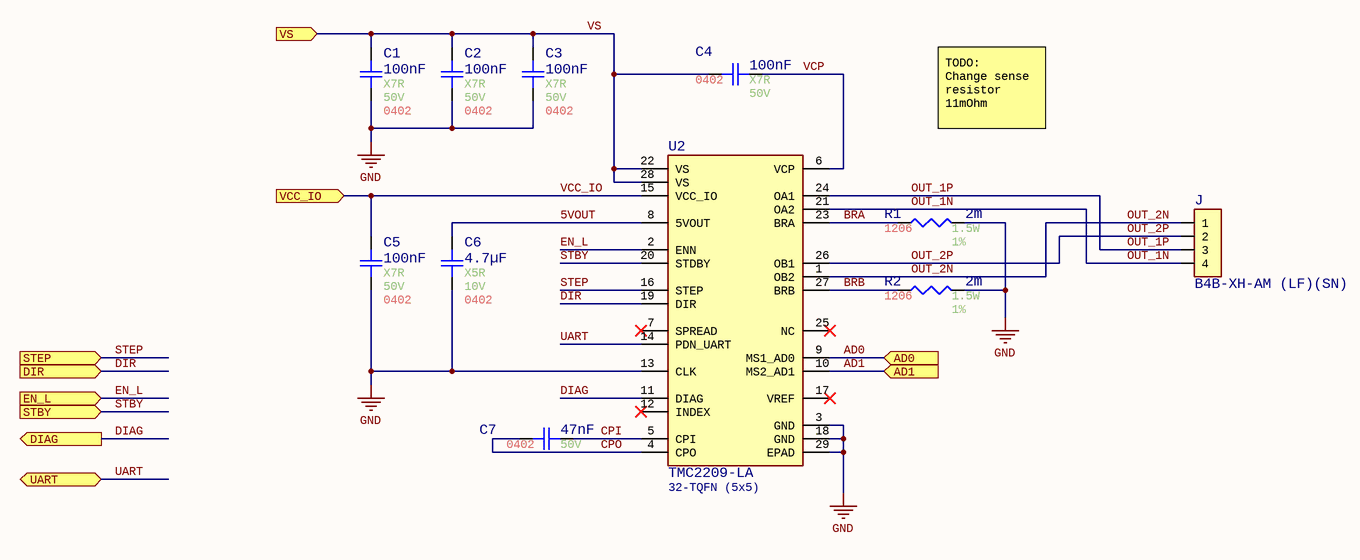
[diagram p10: stepper_driver.SchDoc]

### Parts
C1  value 100nF  Temperature Coefficient: X7R  Voltage Rating: 50V  Case/Package: 0402  [Generic 0402 capacitor]  (hidden comment: GRT155R71H104KE01D)
C2  value 100nF  Temperature Coefficient: X7R  Voltage Rating: 50V  Case/Package: 0402  [Generic 0402 capacitor]  (hidden comment: GRT155R71H104KE01D)
C3  value 100nF  Temperature Coefficient: X7R  Voltage Rating: 50V  Case/Package: 0402  [Generic 0402 capacitor]  (hidden comment: GRT155R71H104KE01D)
C4  value 100nF  Temperature Coefficient: X7R  Voltage Rating: 50V  Case/Package: 0402  [Generic 0402 capacitor]  (hidden comment: GRT155R71H104KE01D)
C5  value 100nF  Temperature Coefficient: X7R  Voltage Rating: 50V  Case/Package: 0402  [Generic 0402 capacitor]  (hidden comment: GRT155R71H104KE01D)
C6  value 4.7µF  Temperature Coefficient: X5R  Voltage Rating: 10V  Case/Package: 0402  [Generic 0402 capacitor]  (hidden comment: GRT155R61A475ME13D)
C7  value 47nF  Voltage Rating: 50V  Case/Package: 0402  [Generic 0402 capacitor]  (hidden comment: GRM155R71H473KE14D)
J  B4B-XH-AM (LF)(SN)  [FP-B4B-XH-AM_LF_SN-MFG]
R1  value 2m  Power: 1.5W  Tolerance: 1%  Case/Package: 1206  [Generic 1206 resistor]  (hidden comment: PA1206FRM670R002L)
R2  value 2m  Power: 1.5W  Tolerance: 1%  Case/Package: 1206  [Generic 1206 resistor]  (hidden comment: PA1206FRM670R002L)
U2  TMC2209-LA  Case/Package: 32-TQFN (5x5)  [QFN-28_5x5x0.9mm_P0.5mm]

### Ports
AD0 (in), AD1 (in), DIAG (out), DIR (in), EN_L (in), STBY (in), STEP (in), UART (bidir), VCC_IO (in), VS (in)

### Nets
GND: C1.1 C2.1 C3.1 C5.1 C6.1 R1.2 R2.2 U2.3(GND) U2.13(CLK) U2.18(GND) U2.29(EPAD)
5VOUT: C6.2 U2.8(5VOUT)
AD0: U2.9(MS1_AD0) ; port AD0
AD1: U2.10(MS2_AD1) ; port AD1
BRA: R1.1 U2.23(BRA)
BRB: R2.1 U2.27(BRB)
CPI: C7.1 U2.5(CPI)
CPO: C7.2 U2.4(CPO)
DIAG: U2.11(DIAG) ; port DIAG
DIR: U2.19(DIR) ; port DIR
EN_L: U2.2(ENN) ; port EN_L
OUT_1N: J.4 U2.21(OA2)
OUT_1P: J.3 U2.24(OA1)
OUT_2N: J.1 U2.1(OB2)
OUT_2P: J.2 U2.26(OB1)
STBY: U2.20(STDBY) ; port STBY
STEP: U2.16(STEP) ; port STEP
UART: U2.14(PDN_UART) ; port UART
VCC_IO: C5.2 U2.15(VCC_IO) ; port VCC_IO
VCP: C4.1 U2.6(VCP)
VS: C1.2 C2.2 C3.2 C4.2 U2.22(VS) U2.28(VS) ; port VS

Not connected (* = marked no-connect by the designer): U2 7(SPREAD)* 12(INDEX)* 17(VREF)* 25(NC)*

### Channels
STP/STP1: designators end in _STP1; ports AD0=GND AD1=GND DIAG=DIAG1 DIR=DIR1 EN_L=STP_EN_L STBY=STBY_STP1 STEP=STEP1 UART=UART_BANK1 VCC_IO=3V3_LOGIC VS=24V_MAIN
STP/STP2: designators end in _STP2; ports AD0=3V3_LOGIC AD1=GND DIAG=DIAG2 DIR=DIR2 EN_L=STP_EN_L STBY=STBY_STP2 STEP=STEP2 UART=UART_STP2 VCC_IO=3V3_LOGIC VS=24V_MAIN
STP/STP3: designators end in _STP3; ports AD0=GND AD1=3V3_LOGIC DIAG=DIAG3 DIR=DIR3 EN_L=STP_EN_L STBY=STBY_STP3 STEP=STEP3 UART=UART_STP3 VCC_IO=3V3_LOGIC VS=24V_MAIN
STP/STP4: designators end in _STP4; ports AD0=3V3_LOGIC AD1=3V3_LOGIC DIAG=DIAG4 DIR=DIR4 EN_L=STP_EN_L STBY=STBY_STP4 STEP=STEP4 UART=UART_BANK1 VCC_IO=3V3_LOGIC VS=24V_MAIN
STP/STP5: designators end in _STP5; ports AD0=GND AD1=GND DIAG=DIAG5 DIR=DIR5 EN_L=STP_EN_L STBY=STBY_STP5 STEP=STEP5 UART=UART_BANK2 VCC_IO=3V3_LOGIC VS=24V_MAIN
STP/STP6: designators end in _STP6; ports AD0=3V3_LOGIC AD1=GND DIAG=DIAG6 DIR=DIR6 EN_L=STP_EN_L STBY=STBY_STP6 STEP=STEP6 UART=UART_BANK2 VCC_IO=3V3_LOGIC VS=24V_MAIN
STP/STP7: designators end in _STP7; ports AD0=GND AD1=3V3_LOGIC DIAG=DIAG7 DIR=DIR7 EN_L=STP_EN_L STBY=STBY_STP7 STEP=STEP7 UART=UART_BANK2 VCC_IO=3V3_LOGIC VS=24V_MAIN
STP/STP8: designators end in _STP8; ports AD0=3V3_LOGIC AD1=3V3_LOGIC DIAG=DIAG8 DIR=DIR8 EN_L=STP_EN_L STBY=STBY_STP8 STEP=STEP8 UART=UART_BANK2 VCC_IO=3V3_LOGIC VS=24V_MAIN

### Notes on the sheet
- TODO:
  Change sense resistor 11mOhm
- Title:
- Author:
- Approved:
- Size:
- Date:
- Git Hash:
- Sch Revision:
- B
- Prj:
- SCH PN:
- Variant:
- Edited:
- CONFIDENTIAL
- File:

### Library data of the parts
C1-C5 = CMP-001-00084-12: as C1 on sheet button_input; Terminal Finish: Nickel; Capacitor Type: Ceramic; Package Shape: Rectangular; Reach SVHC Compliant: Yes; Max Operating Temperature: 125°C; RoHS Compliant: Yes; Termination: Wraparound; Packaging: Tape and Reel; AECQ: Yes; Pins: 2; Dielectric Material: Ceramic; Min Operating Temperature: -55°C; Tolerance: 10%; Mounting Technology: Surface Mount
C6 = CMP-001-00085-5: Ceramic Capacitor, Multilayer, Ceramic, 10V, 20% +Tol, 20% -Tol, X5R, 15% TC, 4.7uF, Surface Mount, 0402; Multilayer: Yes; Tolerance: 0%; Reach SVHC Compliant: Yes; Tolerance (fill in as +-): 20%; Packaging: Tape and Reel; Dielectric Material: Ceramic; Mounting Technology: Surface Mount; RoHS Compliant: Yes; Tolerance  (fill in as +-): 20%; Rated DC Voltage (URdc): 10V; Package Shape: Rectangular; Termination: Wraparound; Pins: 2; Max Operating Temperature: 85°C; Capacitor Type: Ceramic; Min Operating Temperature: -55°C; AECQ: Yes
C7 = CMP-001-00113-1: 50V 47nF X7R ±10% 0402 Multilayer Ceramic Capacitors MLCC - SMD/SMT ROHS; AECQ: No; Mounting Technology: SMD; Tolerance: 10%; Pins: 2; Min Operating Temperature: -55°C; Max Operating Temperature: 125°C; Capacitor Type: Ceramic
J = CMP-002-00133-1: as J1_ENET on sheet ENET; Length: 12.4mm; Min Operating Temperature: -25°C; Max Operating Temperature: 85°C; Pins: 4; Manufacturer Series: XH; Case/Package: THT; Height: 7mm; Connector Type: Header
R1 R2 = CMP-009-00231-1: Res 0.002 Ohm 1% 1.5W 1206; Manufacturer Part Number: Blank; AECQ: Yes; Max Operating Temperature: 170°C; Min Operating Temperature: -55°C; Pins: 2; Mounting Technology: SMD
U2 = CMP-031-00019-2: Step/Direction StealthChop Stepper Motor Driver Two-Phase 4.75V to 29V 28-Pin QFN Tray; MPN: TMC5240ATJ+T; Min Supply Voltage: 1.5V; AECQ: No; Max Supply Voltage: 29V; Min Operating Temperature: -40°C; Pins: 32; Max Operating Temperature: 125°C; Mounting Technology: SMD

## Sheet coil_driver.SchDoc: Fan Driver
size 431 x 279 mm; Author: Shivam Sharma; DrawnBy: Fans; SheetNumber: 5; SheetTotal: 14; SheetRevision: 1.0
Used 8 times, as channels COIL1, COIL2, COIL3, COIL4, COIL5, COIL6, COIL7, COIL8. Parts and nets are listed once, with the designators drawn on the sheet.
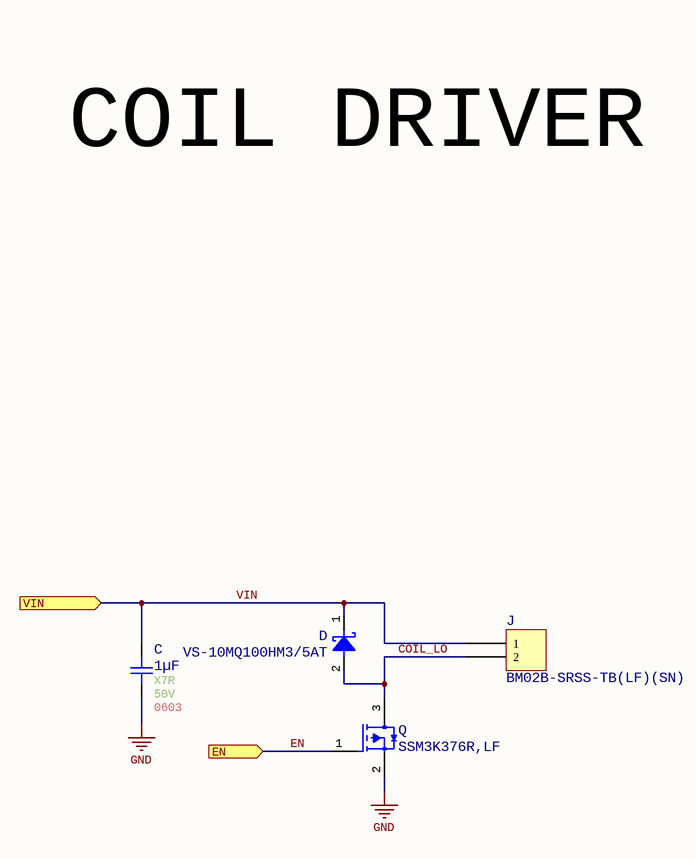
[diagram p11: coil_driver.SchDoc]

### Parts
C  value 1µF  Temperature Coefficient: X7R  Voltage Rating: 50V  Case/Package: 0603  [Generic 0603 Capacitor]  (hidden comment: CGA3E3X7R1H105K080AB)
D  VS-10MQ100HM3/5AT  [FP-95400-MFG]
J  BM02B-SRSS-TB(LF)(SN)  [JST BM02B-SRSS-TB]
Q  SSM3K376R,LF  [SSM3K376R,LF]

### Ports
EN (in), VIN (in)

### Nets
GND: C.1 Q.2(S)
COIL_LO: D.2(A) J.2 Q.3(D)
EN: Q.1(G) ; port EN
VIN: C.2 D.1(C) J.1 ; port VIN

### Channels
COIL1: designators end in _COIL1; ports EN=COIL_EN1 VIN=24V_MAIN
COIL2: designators end in _COIL2; ports EN=COIL_EN2 VIN=24V_MAIN
COIL3: designators end in _COIL3; ports EN=COIL_EN3 VIN=24V_MAIN
COIL4: designators end in _COIL4; ports EN=COIL_EN4 VIN=24V_MAIN
COIL5: designators end in _COIL5; ports EN=COIL_EN5 VIN=24V_MAIN
COIL6: designators end in _COIL6; ports EN=COIL_EN6 VIN=24V_MAIN
COIL7: designators end in _COIL7; ports EN=COIL_EN7 VIN=24V_MAIN
COIL8: designators end in _COIL8; ports EN=COIL_EN8 VIN=24V_MAIN

### Notes on the sheet
- COIL DRIVER
- Title:
- Author:
- Approved:
- Size:
- Date:
- Git Hash:
- Sch Revision:
- B
- Prj:
- Sheet Revision:
- Variant:
- Edited:
- CONFIDENTIAL
- File:

### Library data of the parts
C = CMP-001-00097-2: Automotive Grade, Mlcc, 0603, X7R, 5; Tolerance: 10%; AECQ: Yes; Capacitor Type: Ceramic; RoHS Compliant: Yes; Pins: 2; Max Operating Temperature: 125°C; Min Operating Temperature: -55°C
D = CMP-00005-4: Rectifier Diode, Schottky, 1 Phase, 1 Element, 1.5A, 100V V(RRM), Silicon, DO-214AC; AECQ: Yes; Package Body Material: Plastic; Reference Standard: AEC-Q101; Forward Voltage: 780mV; Number of Elements: 1; Forward Current: 1A; Time @ Peak Reflow Temperature-Max (s): 10s; Reach SVHC Compliant: No; Terminal Finish: Tin; Surface Mount: Yes; Peak Reflow Temperature (Cel): 260°C; Package Style: SMALL OUTLINEMeter; JEDEC-95 Code: DO-214AC; Max Operating Temperature: 150°C; RoHS Compliant: Yes; Case/Package: DO-214AC; Diode Element Material: SILICON; Min Operating Temperature: -55°C; Rep Pk Reverse Voltage-Max: 100V; Moisture Sensitivity Level: 1; Diode Type: RECTIFIER; JESD-30 Code: R-PDSO-C2; JESD-609 Code: e3; Technology: SCHOTTKY; Package Shape: Rectangular; Pins: 2
J = BM02B-SRSS-TB(LF)(SN): as J on sheet button_input; Part Number: BM02B-SRSS-TB(LF)(SN); ComponentLink1Description: Datasheet; ComponentLink1URL: http://www.jst-mfg.com/product/pdf/eng/eSR.pdf; ComponentLink2Description: DigiKey Link; ComponentLink2URL: http://digikey.com/product-detail/en/jst-sales-america-inc/BM02B-SRSS-TB-LF-SN/455-1788-1-ND/926859; Connector Type: Header; Contact Finish - Mating: Tin; Contact Finish - Post: Tin; Contact Material: Copper Alloy; Contact Shape: Square; Contact Type: Male Pin; Fastening Type: Push-Pull; Features: Solder Retention; Insulation Color: Natural; Insulation Height: 0.167" (4.25mm); Insulation Material: Polyamide (PA), Nylon; LastUpdated: 1/12/2020 10:11:04 PM; Lifecycle Status: Active; Minimum Order: 1; Mounting Type: Surface Mount; Number of Rows: 1; Operating Temperature: -25°C ~ 85°C; Packaging: TapeAndReel; PartId: 12; Part Status: Active; Price: 0.22; Series: SR; Supplier 1: DigiKey; Supplier Part Number 1: 455-1788-1-ND; Termination: Solder
Q = CMP-013-00038-2: Transistor MOSFET N-CH 30V 4A 3-Pin SOT-23F Emboss T/R; Transistor Type: n-FET; Vgs(th) (Max) @ Id: 1V; Vgs (Max): 12V; RoHS Compliant: Yes; Max Operating Temperature: 150°C; Pins: 3; Case/Package: SOT-23F; Mounting Technology: SMD

## Nets that join several sheets
3V3_LOGIC: Top (C1.2 R1.2 U1.21 U1.23), Power (R7_PWR.2), CAN0 (C1_CAN0.1 U1_CAN0.5), CAN1 (C1_CAN1.1 U1_CAN1.5), ENET (27 pins), SD_Card (7 pins), STP/STP1 (C5_STP1.2 U2_STP1.15), STP/STP2 (C5_STP2.2 U2_STP2.9 U2_STP2.15), STP/STP3 (C5_STP3.2 U2_STP3.10 U2_STP3.15), STP/STP4 (C5_STP4.2 U2_STP4.9 U2_STP4.10 U2_STP4.15), STP/STP5 (C5_STP5.2 U2_STP5.15), STP/STP6 (C5_STP6.2 U2_STP6.9 U2_STP6.15), STP/STP7 (C5_STP7.2 U2_STP7.10 U2_STP7.15), STP/STP8 (C5_STP8.2 U2_STP8.9 U2_STP8.10 U2_STP8.15)
3V3_MCU: MCU (24 pins), Power (R6_PWR.2), BTN1 (R1_BTN1.2), BTN2 (R1_BTN2.2), BTN3 (R1_BTN3.2), BTN4 (R1_BTN4.2), BTN5 (R1_BTN5.2), BTN6 (R1_BTN6.2), BTN7 (R1_BTN7.2), BTN8 (R1_BTN8.2)
5V0_LOGIC: Power (R5_PWR.2), 5V_Buck (5 pins), CAN0 (C2_CAN0.1 U1_CAN0.3), CAN1 (C2_CAN1.1 U1_CAN1.3)
24V_IN: Power (J1_PWR.1 R1_PWR.2), Input_Protection (Q1_IP.5 R2_IP.2 R3_IP.2 U1_IP.1)
24V_MAIN: Power (5 pins), Input_Protection (C1_IP.1 C2_IP.2 C3_IP.2 R1_IP.2), 5V_Buck (5 pins), STP/STP1 (6 pins), STP/STP2 (6 pins), STP/STP3 (6 pins), STP/STP4 (6 pins), STP/STP5 (6 pins), STP/STP6 (6 pins), STP/STP7 (6 pins), STP/STP8 (6 pins), COIL1 (C_COIL1.2 D_COIL1.1 J_COIL1.1), COIL2 (C_COIL2.2 D_COIL2.1 J_COIL2.1), COIL3 (C_COIL3.2 D_COIL3.1 J_COIL3.1), COIL4 (C_COIL4.2 D_COIL4.1 J_COIL4.1), COIL5 (C_COIL5.2 D_COIL5.1 J_COIL5.1), COIL6 (C_COIL6.2 D_COIL6.1 J_COIL6.1), COIL7 (C_COIL7.2 D_COIL7.1 J_COIL7.1), COIL8 (C_COIL8.2 D_COIL8.1 J_COIL8.1)
GND: Top (C1.1 U1.9 U1.18 U1.25), MCU (34 pins), Power (16 pins), Input_Protection (8 pins), 5V_Buck (7 pins), CAN0 (8 pins), CAN1 (8 pins), ENET (28 pins), SD_Card (7 pins), BTN1 (C1_BTN1.1 J_BTN1.2), BTN2 (C1_BTN2.1 J_BTN2.2), BTN3 (C1_BTN3.1 J_BTN3.2), BTN4 (C1_BTN4.1 J_BTN4.2), BTN5 (C1_BTN5.1 J_BTN5.2), BTN6 (C1_BTN6.1 J_BTN6.2), BTN7 (C1_BTN7.1 J_BTN7.2), BTN8 (C1_BTN8.1 J_BTN8.2), STP/STP1 (13 pins), STP/STP2 (12 pins), STP/STP3 (12 pins), STP/STP4 (11 pins), STP/STP5 (13 pins), STP/STP6 (12 pins), STP/STP7 (12 pins), STP/STP8 (11 pins), COIL1 (C_COIL1.1 Q_COIL1.2), COIL2 (C_COIL2.1 Q_COIL2.2), COIL3 (C_COIL3.1 Q_COIL3.2), COIL4 (C_COIL4.1 Q_COIL4.2), COIL5 (C_COIL5.1 Q_COIL5.2), COIL6 (C_COIL6.1 Q_COIL6.2), COIL7 (C_COIL7.1 Q_COIL7.2), COIL8 (C_COIL8.1 Q_COIL8.2)
CAN0_MCU_TO_PHY_DATA: MCU (U1_MCU.82), CAN0 (U1_CAN0.1)
CAN0_PHY_TO_MCU_DATA: MCU (U1_MCU.81), CAN0 (U1_CAN0.4)
CAN1_MCU_TO_PHY_DATA: MCU (U1_MCU.92), CAN1 (U1_CAN1.1)
CAN1_PHY_TO_MCU_DATA: MCU (U1_MCU.91), CAN1 (U1_CAN1.4)
ENET_MDC: MCU (U1_MCU.16), ENET (R18_ENET.1 U1_ENET.12)
ENET_MDIO: MCU (U1_MCU.24), ENET (R16_ENET.1 U1_ENET.11)
RMII_MAC_TO_PHY_D0: MCU (U1_MCU.51), ENET (R5_ENET.2)
RMII_MAC_TO_PHY_D1: MCU (U1_MCU.52), ENET (R6_ENET.2)
RMII_MAC_TO_PHY_EN: MCU (U1_MCU.47), ENET (R4_ENET.2)
RMII_PHY_TO_MAC_CLK: MCU (U1_MCU.23), ENET (R9_ENET.2)
RMII_PHY_TO_MAC_D0: MCU (U1_MCU.32), ENET (R11_ENET.2)
RMII_PHY_TO_MAC_D1: MCU (U1_MCU.33), ENET (R12_ENET.2)
RMII_PHY_TO_MAC_DV: MCU (U1_MCU.31), ENET (R8_ENET.2)
STP_EN_L: STP/STP1 (U2_STP1.2), STP/STP2 (U2_STP2.2), STP/STP3 (U2_STP3.2), STP/STP4 (U2_STP4.2), STP/STP5 (U2_STP5.2), STP/STP6 (U2_STP6.2), STP/STP7 (U2_STP7.2), STP/STP8 (U2_STP8.2)
UART_BANK1: STP/STP1 (U2_STP1.14), STP/STP4 (U2_STP4.14)
UART_BANK2: STP/STP5 (U2_STP5.14), STP/STP6 (U2_STP6.14), STP/STP7 (U2_STP7.14), STP/STP8 (U2_STP8.14)

## Assembly variants
Main: not fitted R19_ENET R20_ENET R21_ENET R22_ENET R27_ENET R28_ENET R33_ENET R34_ENET R35_ENET R36_ENET